# Altium schematic sheet RN42.SchDoc
size A
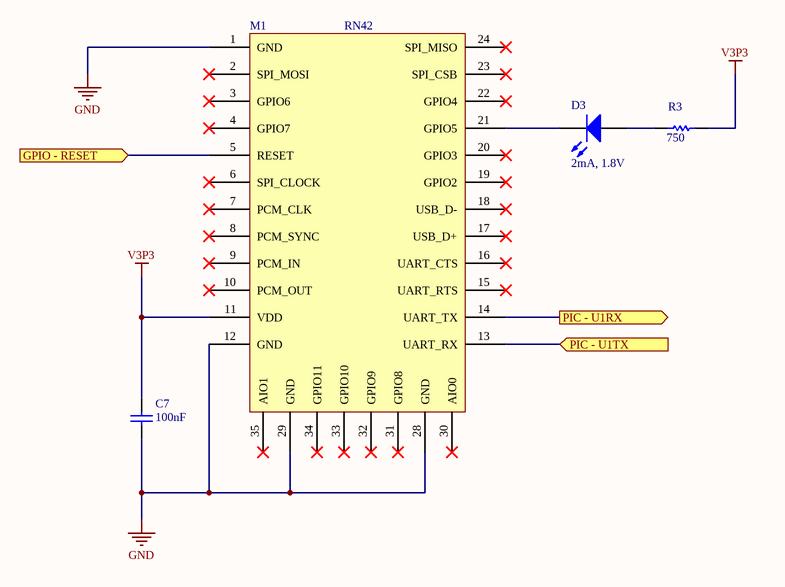
[diagram p0: RN42.SchDoc]

## Parts
C7  value 100nF  [CAP 0603]  (hidden comment: Cap)
D3  2mA, 1.8V  [LED]
M1  RN42  [RN42]
R3  750  [RES 0603]

## Ports
GPIO - RESET (in), PIC - U1RX (out), PIC - U1TX (in)

## Nets
GND: C7.1 M1.1(GND) M1.12(GND) M1.28(GND) M1.29(GND)
V3P3: C7.2 M1.11(VDD) R3.2
GPIO - RESET: M1.5(RESET) ; port GPIO - RESET
PIC - U1RX: M1.14(UART_TX) ; port PIC - U1RX
PIC - U1TX: M1.13(UART_RX) ; port PIC - U1TX
NetD3_1: D3.1(A) R3.1
NetD3_2: D3.2(K) M1.21(GPIO5)

Not connected (* = marked no-connect by the designer): M1 2(SPI_MOSI)* 3(GPIO6)* 4(GPIO7)* 6(SPI_CLOCK)* 7(PCM_CLK)* 8(PCM_SYNC)* 9(PCM_IN)* 10(PCM_OUT)* 15(UART_RTS)* 16(UART_CTS)* 17(USB_D+)* 18(USB_D-)* 19(GPIO2)* 20(GPIO3)* 22(GPIO4)* 23(SPI_CSB)* 24(SPI_MISO)* 30(AIO0)* 31(GPIO8)* 32(GPIO9)* 33(GPIO10)* 34(GPIO11)* 35(AIO1)*

## Library data of the parts
C7 = Cap: Capacitor; PackageReference: RAD-0.3; PackageDescription: Radial Cap, Thru-Hole; 2 Leads; 0.3 in Pin Spacing
D3 = LED0: Typical INFRARED GaAs LED; Fabricant: Kingbright; Fournisseur: Farnell; RefFabricant: KPT-2012LVSECK-J3-PRV; RefFournisseur: 2610416; PackageReference: LED-0; PackageDescription: LED; 2 Leads; Value: 2mA, 1.8V
M1 = RN42: RN42 Bluetooth Module by Roven Networks; Fournisseur: Farnell; Fabricant: Microchip; RefFabricant: RN42HID-I/RM; RefFournisseur: 2775075; PackageDescription: Bluetooth
R3 = Res1: Resistor; PackageReference: AXIAL-0.3; PackageDescription: Axial Device, Thru-Hole; 2 Leads; 0.3 in Pin Spacing; Value: 750